# EAGLE schematic heliostat (EAGLE 7.2.0)
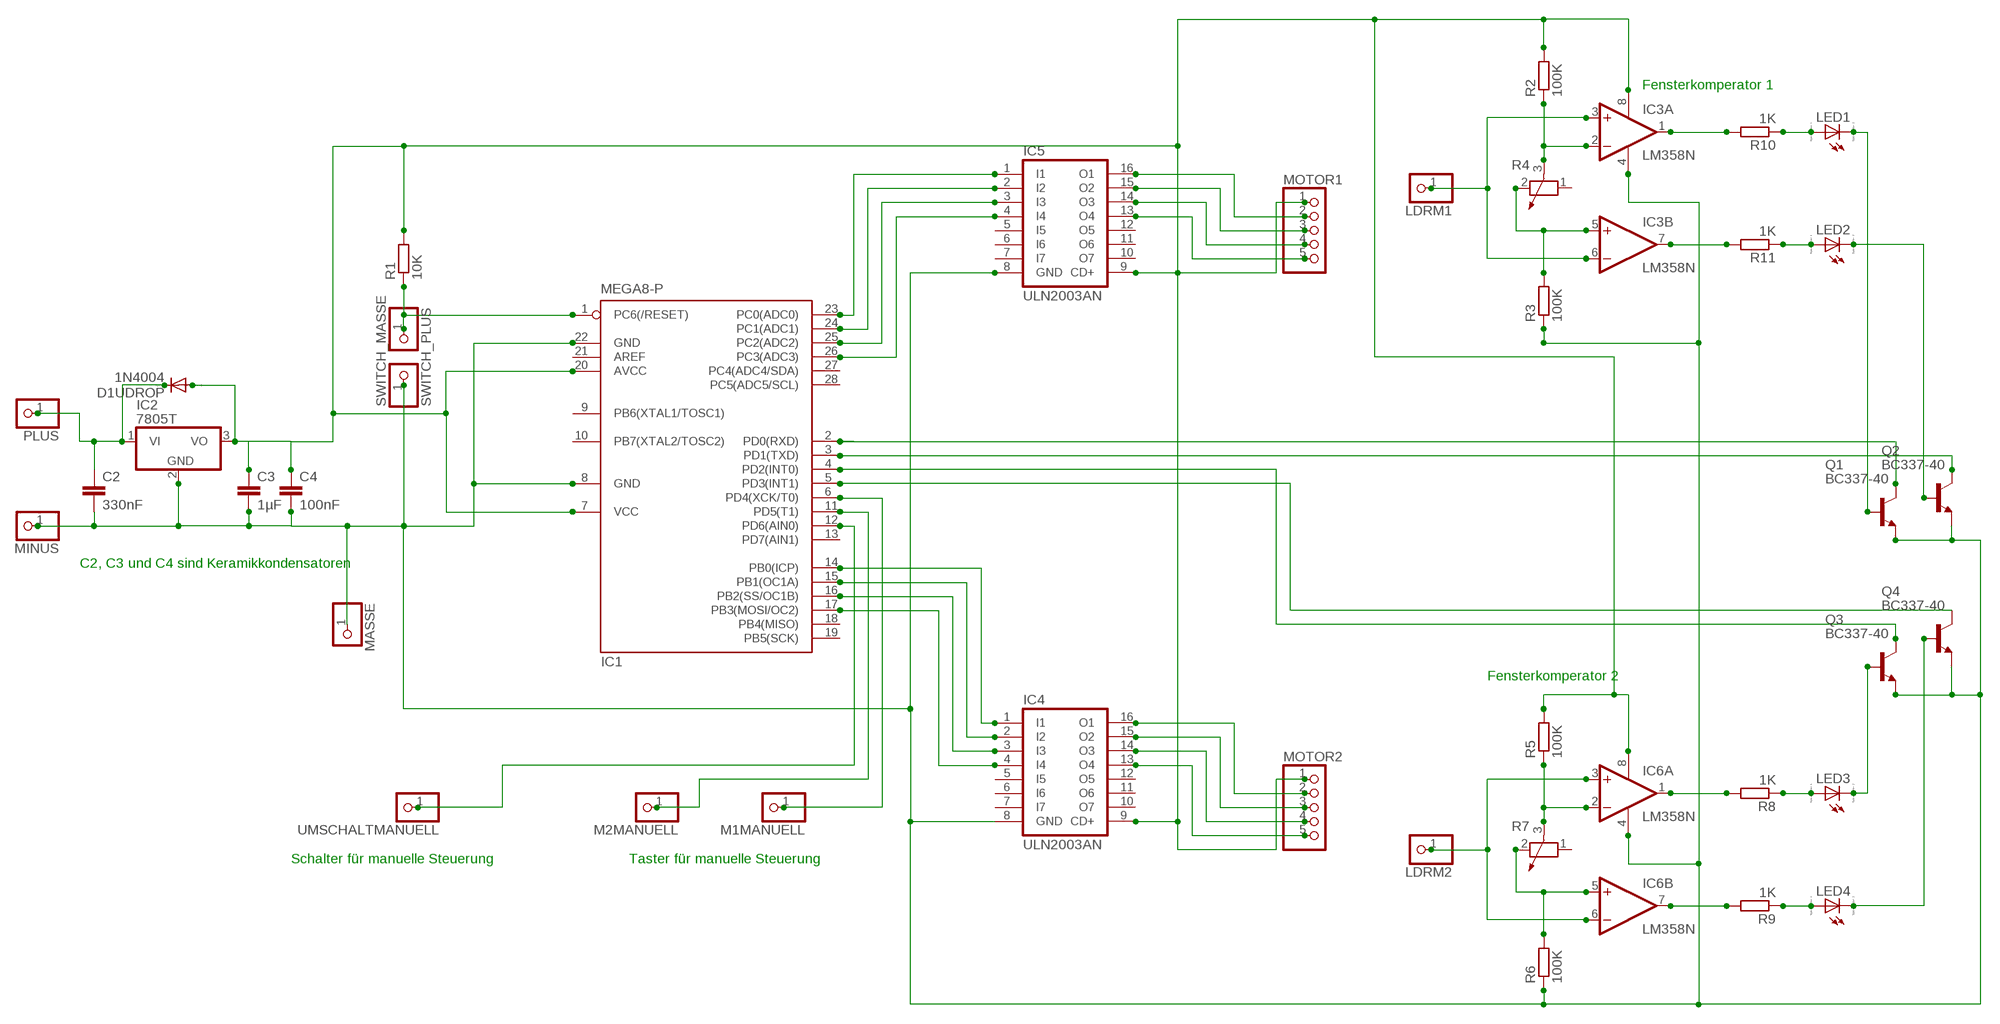
[diagram p0: schematic, sheet 1]

## Parts
C2  330nF  C-EU025-024X044  [C025-024X044]
C3  1µF  C-EU025-024X044  [C025-024X044]
C4  100nF  C-EU025-024X044  [C025-024X044]
D1UDROP  1N4004  [DO41-10]
IC1  MEGA8-P  [DIL28-3]
IC2  7805T  [TO220H]
IC3  LM358N  [DIL08]
IC4  ULN2003AN  [DIL16]
IC5  ULN2003AN  [DIL16]
IC6  LM358N  [DIL08]
LDRM1  PINHD-1X1  [1X01]
LDRM2  PINHD-1X1  [1X01]
LED1  LED_ELD260  [LED_LD260]
LED2  LED_ELD260  [LED_LD260]
LED3  LED_ELD260  [LED_LD260]
LED4  LED_ELD260  [LED_LD260]
M1MANUELL  PINHD-1X1  [1X01]
M2MANUELL  PINHD-1X1  [1X01]
MASSE  PINHD-1X1  [1X01]
MINUS  PINHD-1X1  [1X01]
MOTOR1  PINHD-1X5  [1X05]
MOTOR2  PINHD-1X5  [1X05]
PLUS  PINHD-1X1  [1X01]
Q1  BC337-40  [TO92]
Q2  BC337-40  [TO92]
Q3  BC337-40  [TO92]
Q4  BC337-40  [TO92]
R1  10K  R-EU_0204/2V  [0204V]
R2  100K  R-EU_0204/2V  [0204V]
R3  100K  R-EU_0204/2V  [0204V]
R4  POTENTIOMETER_PT-10  [PT-10]
R5  100K  R-EU_0204/2V  [0204V]
R6  100K  R-EU_0204/2V  [0204V]
R7  POTENTIOMETER_PT-10  [PT-10]
R8  1K  R-EU_0204/2V  [0204V]
R9  1K  R-EU_0204/2V  [0204V]
R10  1K  R-EU_0204/2V  [0204V]
R11  1K  R-EU_0204/2V  [0204V]
SWITCH_MASSE  PINHD-1X1  [1X01]
SWITCH_PLUS  PINHD-1X1  [1X01]
UMSCHALTMANUELL  PINHD-1X1  [1X01]

## Nets
N$1: IC1.23(PC0(ADC0)) IC5.1(I1)
N$2: IC3.2(A:-IN) R2.1 R4.3
N$3: IC1.24(PC1(ADC1)) IC5.2(I2)
N$4: C2.1 D1UDROP.C IC2.1(VI) PLUS.1
N$5: IC1.2(PD0(RXD)) Q1.3(C)
N$6: IC1.25(PC2(ADC2)) IC5.3(I3)
N$7: IC1.26(PC3(ADC3)) IC5.4(I4)
N$8: IC5.16(O1) MOTOR1.2
N$9: IC5.15(O2) MOTOR1.3
N$10: IC5.14(O3) MOTOR1.4
N$11: IC5.13(O4) MOTOR1.5
N$12: IC1.14(PB0(ICP)) IC4.1(I1)
N$13: IC1.15(PB1(OC1A)) IC4.2(I2)
N$14: IC1.16(PB2(SS/OC1B)) IC4.3(I3)
N$15: IC1.17(PB3(MOSI/OC2)) IC4.4(I4)
N$16: IC4.16(O1) MOTOR2.2
N$17: IC4.15(O2) MOTOR2.3
N$18: IC4.14(O3) MOTOR2.4
N$19: IC4.13(O4) MOTOR2.5
N$21: IC3.5(B:+IN) R3.2 R4.2
N$22: C3.1 C4.1 D1UDROP.A IC1.7(VCC) IC1.20(AVCC) IC2.3(VO) IC3.8(P:V+) IC4.9(CD+) IC5.9(CD+) IC6.8(P:V+) MOTOR1.1 MOTOR2.1 R1.2 R2.2 R5.2
N$23: IC3.3(A:+IN) IC3.6(B:-IN) LDRM1.1
N$24: IC6.1(A:OUT) R8.2
N$25: IC6.2(A:-IN) R5.1 R7.3
N$26: IC6.5(B:+IN) R6.2 R7.2
N$27: IC6.3(A:+IN) IC6.6(B:-IN) LDRM2.1
N$28: LED3.A R8.1
N$29: IC6.7(B:OUT) R9.2
N$30: LED4.A R9.1
N$31: IC3.7(B:OUT) R11.2
N$32: LED2.A R11.1
N$33: IC3.1(A:OUT) R10.2
N$34: LED1.A R10.1
N$35: IC1.1(PC6(/RESET)) R1.1 SWITCH_PLUS.1
N$36: IC1.6(PD4(XCK/T0)) M1MANUELL.1
N$37: LED1.K(C) Q1.2(B)
N$38: LED2.K(C) Q2.2(B)
N$39: IC1.3(PD1(TXD)) Q2.3(C)
N$40: LED3.K(C) Q3.2(B)
N$41: IC1.4(PD2(INT0)) Q3.3(C)
N$42: LED4.K(C) Q4.2(B)
N$43: IC1.5(PD3(INT1)) Q4.3(C)
N$44: IC1.11(PD5(T1)) M2MANUELL.1
N$45: C2.2 C3.2 C4.2 IC1.8(GND) IC1.22(GND) IC2.2(GND) IC3.4(P:V-) IC4.8(GND) IC5.8(GND) IC6.4(P:V-) MASSE.1 MINUS.1 Q1.1(E) Q2.1(E) Q3.1(E) Q4.1(E) R3.1 R6.1 SWITCH_MASSE.1
N$46: IC1.12(PD6(AIN0)) UMSCHALTMANUELL.1
Unconnected: IC1.9(PB6(XTAL1/TOSC1)) IC1.10(PB7(XTAL2/TOSC2)) IC1.13(PD7(AIN1)) IC1.18(PB4(MISO)) IC1.19(PB5(SCK)) IC1.21(AREF) IC1.27(PC4(ADC4/SDA)) IC1.28(PC5(ADC5/SCL)) IC4.5(I5) IC4.6(I6) IC4.7(I7) IC4.10(O7) IC4.11(O6) IC4.12(O5) IC5.5(I5) IC5.6(I6) IC5.7(I7) IC5.10(O7) IC5.11(O6) IC5.12(O5) R4.1 R7.1

## Notes on the sheet
- Fensterkomperator 1
- C2, C3 und C4 sind Keramikkondensatoren
- Fensterkomperator 2
- Schalter für manuelle Steuerung | Taster für manuelle Steuerung

## Library data of the parts
C2-C4 = rcl:C-EU: CAPACITOR, European symbol
D1UDROP = diode:1N4004: DIODE general purpose rectifier, 1 A
IC1 = atmel:MEGA8-P: MICROCONTROLLER 8 Kbytes FLASH, 1 kbytes SRAM, 512 bytes EEPROM, USART, 4-channel 10 bit ADC, 2-channel 8 bit ADC Pin compatible with Atmega48, ATMega88, ATMega168 Source: avr.lbr; OC_FARNELL: unknown; OC_NEWARK: unknown
IC2 = linear:78*: Positive VOLTAGE REGULATOR Source: http://cache.national.com/ds/LM/LM78L05.pdf http://www.fairchildsemi.com/ds/LM/LM7805.pdf
IC3 IC6 = linear:LM358: OP AMP also LM158; LM258; LM2904 Source: http://cache.national.com/ds/LM/LM158.pdf
IC4 IC5 = uln-udn:ULN2003A: DRIVER ARRAY
LDRM1 LDRM2 M1MANUELL M2MANUELL MASSE MINUS PLUS SWITCH_MASSE SWITCH_PLUS UMSCHALTMANUELL = pinhead:PINHD-1X1: PIN HEADER
LED1-LED4 = eagle-ltspice:LED_E: LED Source: http://www.osram.convergy.de Source: www.luxeon.com Source: www.kingbright.com; SPICEMODEL: NONE; SPICEPREFIX: D; SPICETYPE: diode
MOTOR1 MOTOR2 = pinhead:PINHD-1X5: PIN HEADER
Q1-Q4 = transistor-npn:BC337*: NPN Transistor
R1-R3 R5 R6 R8-R11 = resistor:R-EU_: RESISTOR, European symbol
R4 R7 = rcl:POTENTIOMETER_: Potentiometer